# EAGLE schematic 32blit (EAGLE 9.6.2)

## Sheet 1 of 3: MCU
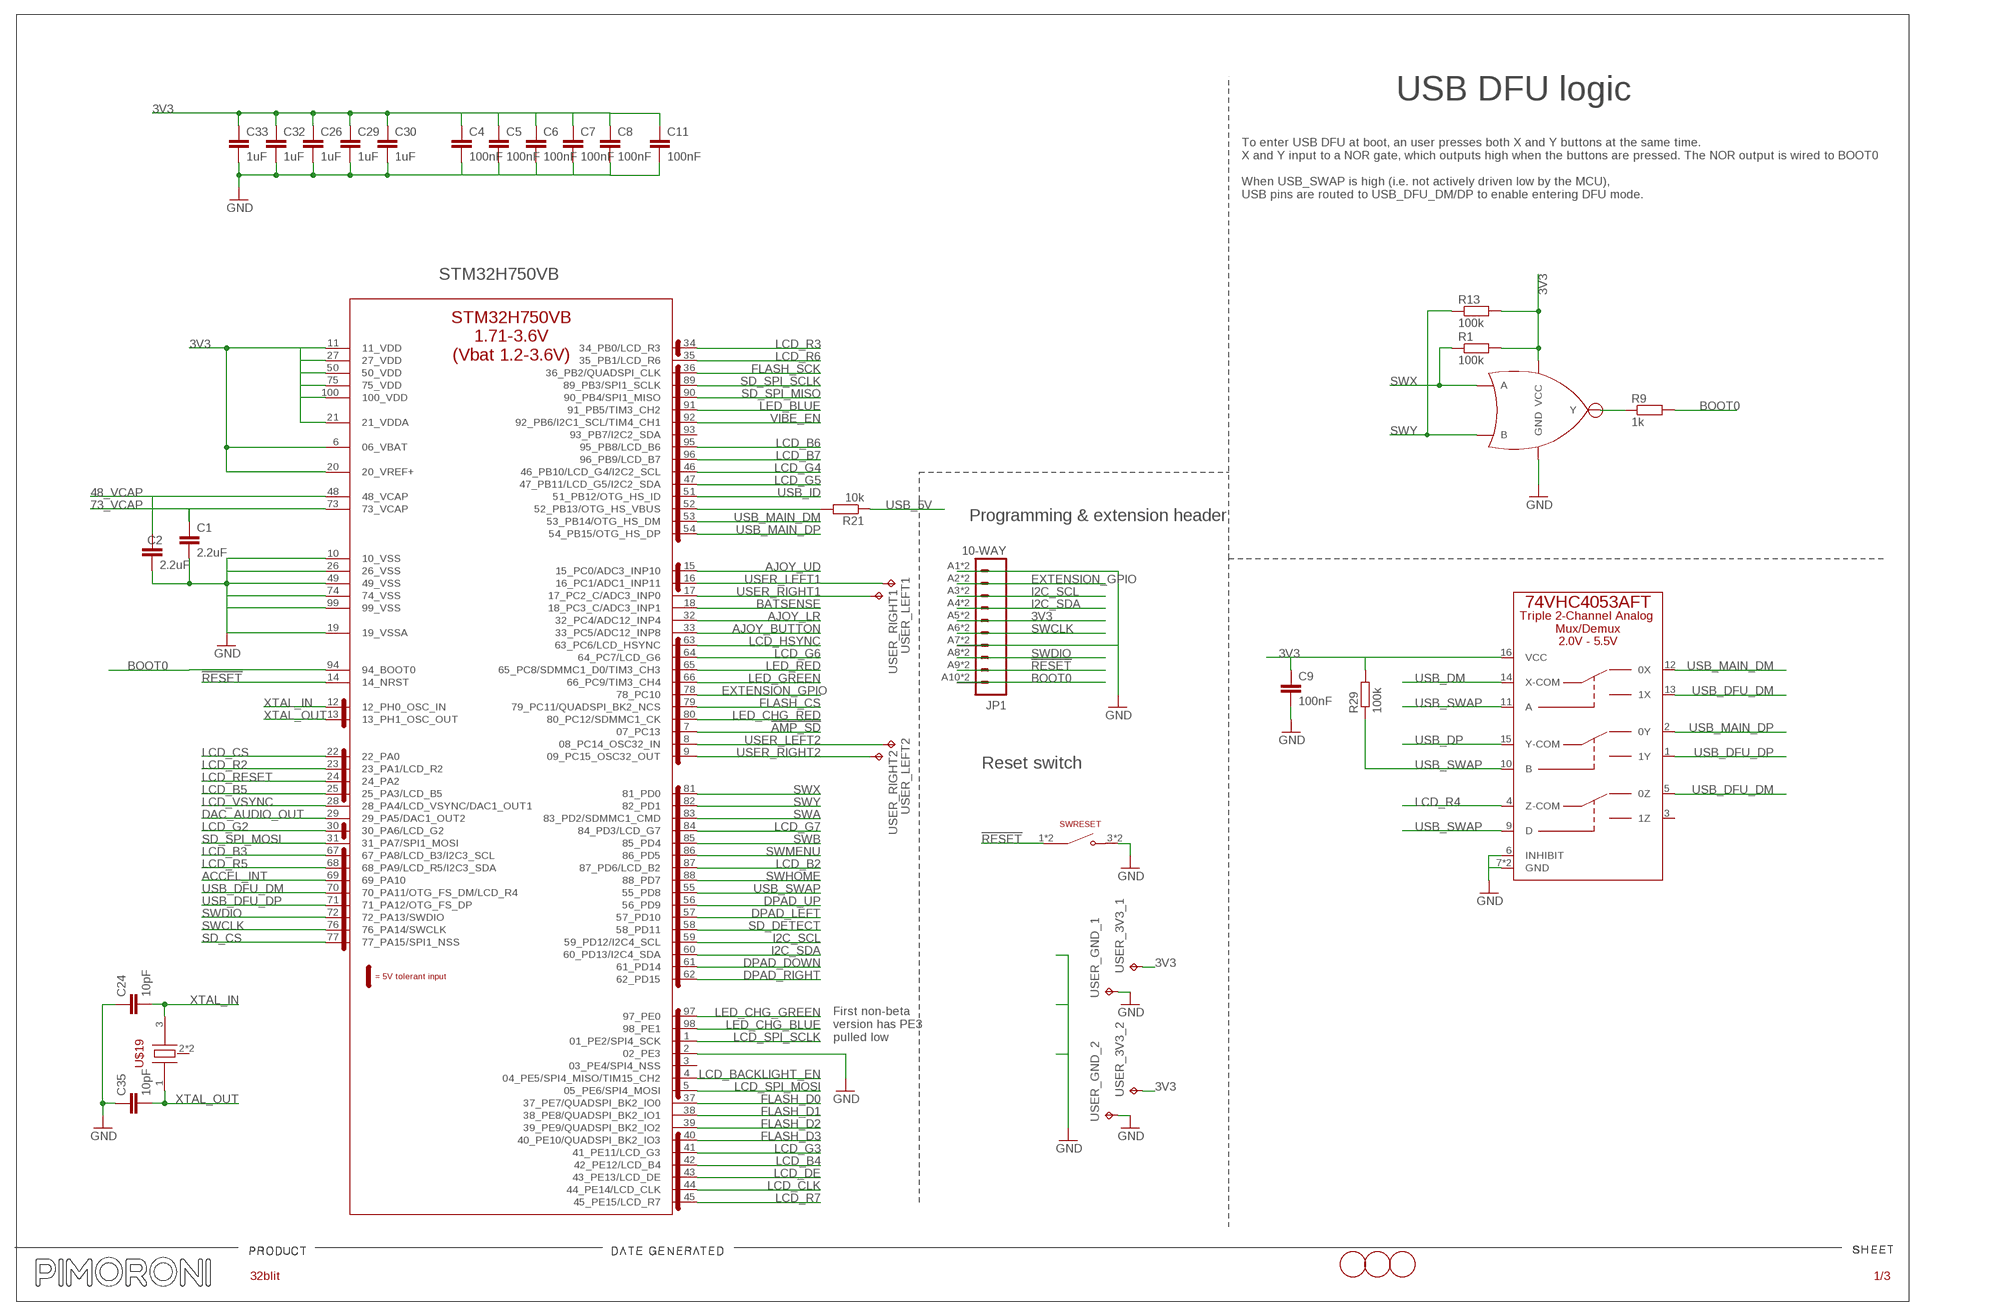
[diagram p0: schematic, sheet 1]

### Parts
C1  2.2uF  C-EUC0603  [C0603]
C2  2.2uF  C-EUC0603  [C0603]
C4  100nF  C-EUC0402K  [C0402K]
C5  100nF  C-EUC0402K  [C0402K]
C6  100nF  C-EUC0402K  [C0402K]
C7  100nF  C-EUC0402K  [C0402K]
C8  100nF  C-EUC0402K  [C0402K]
C9  100nF  C-EUC0402K  [C0402K]
C11  100nF  C-EUC0402K  [C0402K]
C24  10pF  C-EUC0603K  [C0603K]
C26  1uF  C-EUC0603  [C0603]
C29  1uF  C-EUC0603  [C0603]
C30  1uF  C-EUC0603  [C0603]
C32  1uF  C-EUC0603  [C0603]
C33  1uF  C-EUC0603  [C0603]
C35  10pF  C-EUC0603K  [C0603K]
JP1  10-WAY  [1X10_FEMALE_SMT_RIGHT_ANGLE]
R1  100k  R-EU_R0603  [R0603]
R9  1k  R-EU_R0603  [R0603]
R13  100k  R-EU_R0603  [R0603]
R21  10k  R-EU_R0603  [R0603]
R29  100k  R-EU_R0603  [R0603]
STM32H750  STM32H750VB  [LQFP-100]
SWRESET  LY-A03-02  TACT_SWITCHLOWPROFILE  [TACT_RIGHT_ANGLE_LOW_PROFILE]
U1  SN74AHC1G02  [SOT-23-5]
U8  74VHC4053AFT  [TSSOP-16-TI]
U$17  FIDUCIAL1MM  [FIDUCIAL-1MM]
U$19  ABM8G-12.000MHZ-4Y-T3  TSX-3225  [TSX-3225]
U$22  FIDUCIAL1MM  [FIDUCIAL-1MM]
U$23  FIDUCIAL1MM  [FIDUCIAL-1MM]
USER_3V3_1  TPTP17SQ  [TP17SQ]
USER_3V3_2  TPTP17SQ  [TP17SQ]
USER_GND_1  TPTP17SQ  [TP17SQ]
USER_GND_2  TPTP17SQ  [TP17SQ]
USER_LEFT1  TPTP17SQ  [TP17SQ]
USER_LEFT2  TPTP17SQ  [TP17SQ]
USER_RIGHT1  TPTP17SQ  [TP17SQ]
USER_RIGHT2  TPTP17SQ  [TP17SQ]

### Nets
3V3: C4.1 C5.1 C6.1 C7.1 C8.1 C9.1 C11.1 C26.1 C29.1 C30.1 C32.1 C33.1 JP1.A5 JP1.B5 R1.2 R13.2 R29.2 STM32H750.6(06_VBAT) STM32H750.11(11_VDD) STM32H750.20(20_VREF+) STM32H750.21(21_VDDA) STM32H750.27(27_VDD) STM32H750.50(50_VDD) STM32H750.75(75_VDD) STM32H750.100(100_VDD) U1.5(VCC) U8.16(VCC) USER_3V3_1.TP USER_3V3_2.TP ; also sheet 2,3
48_VCAP: C2.1 STM32H750.48(48_VCAP)
73_VCAP: C1.1 STM32H750.73(73_VCAP)
!AMP_SD: STM32H750.7(07_PC13) ; also sheet 2
!RESET: JP1.A9 JP1.B9 STM32H750.14(14_NRST) SWRESET.1 SWRESET.2
ACCEL_INT: STM32H750.69(69_PA10) ; also sheet 2
AJOY_BUTTON: STM32H750.33(33_PC5/ADC12_INP8) ; also sheet 2
AJOY_LR: STM32H750.32(32_PC4/ADC12_INP4) ; also sheet 2
AJOY_UD: STM32H750.15(15_PC0/ADC3_INP10) ; also sheet 2
BATSENSE: STM32H750.18(18_PC3_C/ADC3_INP1) ; also sheet 3
BOOT0: JP1.A10 JP1.B10 R9.2 STM32H750.94(94_BOOT0)
DAC_AUDIO_OUT: STM32H750.29(29_PA5/DAC1_OUT2) ; also sheet 2
DPAD_DOWN: STM32H750.61(61_PD14) ; also sheet 2
DPAD_LEFT: STM32H750.57(57_PD10) ; also sheet 2
DPAD_RIGHT: STM32H750.62(62_PD15) ; also sheet 2
DPAD_UP: STM32H750.56(56_PD9) ; also sheet 2
EXTENSION_GPIO: JP1.A2 JP1.B2 STM32H750.78(78_PC10)
FLASH_CS: STM32H750.79(79_PC11/QUADSPI_BK2_NCS) ; also sheet 2
FLASH_D0: STM32H750.37(37_PE7/QUADSPI_BK2_IO0) ; also sheet 2
FLASH_D1: STM32H750.38(38_PE8/QUADSPI_BK2_IO1) ; also sheet 2
FLASH_D2: STM32H750.39(39_PE9/QUADSPI_BK2_IO2) ; also sheet 2
FLASH_D3: STM32H750.40(40_PE10/QUADSPI_BK2_IO3) ; also sheet 2
FLASH_SCK: STM32H750.36(36_PB2/QUADSPI_CLK) ; also sheet 2
GND: C1.2 C2.2 C4.2 C5.2 C6.2 C7.2 C8.2 C9.2 C11.2 C24.1 C26.2 C29.2 C30.2 C32.2 C33.2 C35.1 JP1.A1 JP1.A7 JP1.B1 JP1.B7 STM32H750.2(02_PE3) STM32H750.10(10_VSS) STM32H750.19(19_VSSA) STM32H750.26(26_VSS) STM32H750.49(49_VSS) STM32H750.74(74_VSS) STM32H750.99(99_VSS) SWRESET.3 SWRESET.4 U1.3(GND) U8.6(INHIBIT) U8.7(GND) U8.8(GND) USER_GND_1.TP USER_GND_2.TP ; also sheet 2,3
I2C_SCL: JP1.A3 JP1.B3 STM32H750.59(59_PD12/I2C4_SCL) ; also sheet 2,3
I2C_SDA: JP1.A4 JP1.B4 STM32H750.60(60_PD13/I2C4_SDA) ; also sheet 2,3
LCD_B2: STM32H750.87(87_PD6/LCD_B2) ; also sheet 3
LCD_B3: STM32H750.67(67_PA8/LCD_B3/I2C3_SCL) ; also sheet 3
LCD_B4: STM32H750.42(42_PE12/LCD_B4) ; also sheet 3
LCD_B5: STM32H750.25(25_PA3/LCD_B5) ; also sheet 3
LCD_B6: STM32H750.95(95_PB8/LCD_B6) ; also sheet 3
LCD_B7: STM32H750.96(96_PB9/LCD_B7) ; also sheet 3
LCD_BACKLIGHT_EN: STM32H750.4(04_PE5/SPI4_MISO/TIM15_CH2) ; also sheet 3
LCD_CLK: STM32H750.44(44_PE14/LCD_CLK) ; also sheet 3
LCD_CS: STM32H750.22(22_PA0) ; also sheet 3
LCD_DE: STM32H750.43(43_PE13/LCD_DE) ; also sheet 3
LCD_G2: STM32H750.30(30_PA6/LCD_G2) ; also sheet 3
LCD_G3: STM32H750.41(41_PE11/LCD_G3) ; also sheet 3
LCD_G4: STM32H750.46(46_PB10/LCD_G4/I2C2_SCL) ; also sheet 3
LCD_G5: STM32H750.47(47_PB11/LCD_G5/I2C2_SDA) ; also sheet 3
LCD_G6: STM32H750.64(64_PC7/LCD_G6) ; also sheet 3
LCD_G7: STM32H750.84(84_PD3/LCD_G7) ; also sheet 3
LCD_HSYNC: STM32H750.63(63_PC6/LCD_HSYNC) ; also sheet 3
LCD_R2: STM32H750.23(23_PA1/LCD_R2) ; also sheet 3
LCD_R3: STM32H750.34(34_PB0/LCD_R3) ; also sheet 3
LCD_R4: U8.4(Z-COM) ; also sheet 3
LCD_R5: STM32H750.68(68_PA9/LCD_R5/I2C3_SDA) ; also sheet 3
LCD_R6: STM32H750.35(35_PB1/LCD_R6) ; also sheet 3
LCD_R7: STM32H750.45(45_PE15/LCD_R7) ; also sheet 3
LCD_RESET: STM32H750.24(24_PA2) ; also sheet 3
LCD_SPI_MOSI: STM32H750.5(05_PE6/SPI4_MOSI) ; also sheet 3
LCD_SPI_SCLK: STM32H750.1(01_PE2/SPI4_SCK) ; also sheet 3
LCD_VSYNC: STM32H750.28(28_PA4/LCD_VSYNC/DAC1_OUT1) ; also sheet 3
LED_BLUE: STM32H750.91(91_PB5/TIM3_CH2) ; also sheet 2
LED_CHG_BLUE: STM32H750.98(98_PE1) ; also sheet 3
LED_CHG_GREEN: STM32H750.97(97_PE0) ; also sheet 3
LED_CHG_RED: STM32H750.80(80_PC12/SDMMC1_CK) ; also sheet 3
LED_GREEN: STM32H750.66(66_PC9/TIM3_CH4) ; also sheet 2
LED_RED: STM32H750.65(65_PC8/SDMMC1_D0/TIM3_CH3) ; also sheet 2
N$1: R9.1 U1.4(Y)
N$2: R21.2 STM32H750.52(52_PB13/OTG_HS_VBUS)
SD_CS: STM32H750.77(77_PA15/SPI1_NSS) ; also sheet 2
SD_DETECT: STM32H750.58(58_PD11) ; also sheet 2
SD_SPI_MISO: STM32H750.90(90_PB4/SPI1_MISO) ; also sheet 2
SD_SPI_MOSI: STM32H750.31(31_PA7/SPI1_MOSI) ; also sheet 2
SD_SPI_SCLK: STM32H750.89(89_PB3/SPI1_SCLK) ; also sheet 2
SWA: STM32H750.83(83_PD2/SDMMC1_CMD) ; also sheet 2
SWB: STM32H750.85(85_PD4) ; also sheet 2
SWCLK: JP1.A6 JP1.B6 STM32H750.76(76_PA14/SWCLK)
SWDIO: JP1.A8 JP1.B8 STM32H750.72(72_PA13/SWDIO)
SWHOME: STM32H750.88(88_PD7) ; also sheet 2,3
SWMENU: STM32H750.86(86_PD5) ; also sheet 2
SWX: R1.1 STM32H750.81(81_PD0) U1.1(A) ; also sheet 2
SWY: R13.1 STM32H750.82(82_PD1) U1.2(B) ; also sheet 2
USB_5V: R21.1 ; also sheet 3
USB_DFU_DM: STM32H750.70(70_PA11/OTG_FS_DM/LCD_R4) U8.5(0Z) U8.13(1X)
USB_DFU_DP: STM32H750.71(71_PA12/OTG_FS_DP) U8.1(1Y)
USB_DM: U8.14(X-COM) ; also sheet 3
USB_DP: U8.15(Y-COM) ; also sheet 3
USB_ID: STM32H750.51(51_PB12/OTG_HS_ID) ; also sheet 3
USB_MAIN_DM: STM32H750.53(53_PB14/OTG_HS_DM) U8.12(0X)
USB_MAIN_DP: STM32H750.54(54_PB15/OTG_HS_DP) U8.2(0Y)
USB_SWAP: R29.1 STM32H750.55(55_PD8) U8.9(D) U8.10(B) U8.11(A)
USER_LEFT1: STM32H750.16(16_PC1/ADC1_INP11) USER_LEFT1.TP
USER_LEFT2: STM32H750.8(08_PC14_OSC32_IN) USER_LEFT2.TP
USER_RIGHT1: STM32H750.17(17_PC2_C/ADC3_INP0) USER_RIGHT1.TP
USER_RIGHT2: STM32H750.9(09_PC15_OSC32_OUT) USER_RIGHT2.TP
VIBE_EN: STM32H750.92(92_PB6/I2C1_SCL/TIM4_CH1) ; also sheet 2
XTAL_IN: C24.2 STM32H750.12(12_PH0_OSC_IN) U$19.3
XTAL_OUT: C35.2 STM32H750.13(13_PH1_OSC_OUT) U$19.1
Unconnected: STM32H750.3(03_PE4/SPI4_NSS) STM32H750.93(93_PB7/I2C2_SDA) U8.3(1Z) U$19.2(GND) U$19.4(GND)

### Notes on the sheet
- USB DFU logic
- To enter USB DFU at boot, an user presses both X and Y buttons at the same time.
  X and Y input to a NOR gate, which outputs high when the buttons are pressed. The NOR output is wired to BOOT0
  
  When USB_SWAP is high (i.e. not actively driven low by the MCU), 
  USB pins are routed to USB_DFU_DM/DP to enable entering DFU mode.
- STM32H750VB
- Programming & extension header
- Reset switch
- First non-beta 
  version has PE3 
  pulled low

## Sheet 2 of 3: Peripherals
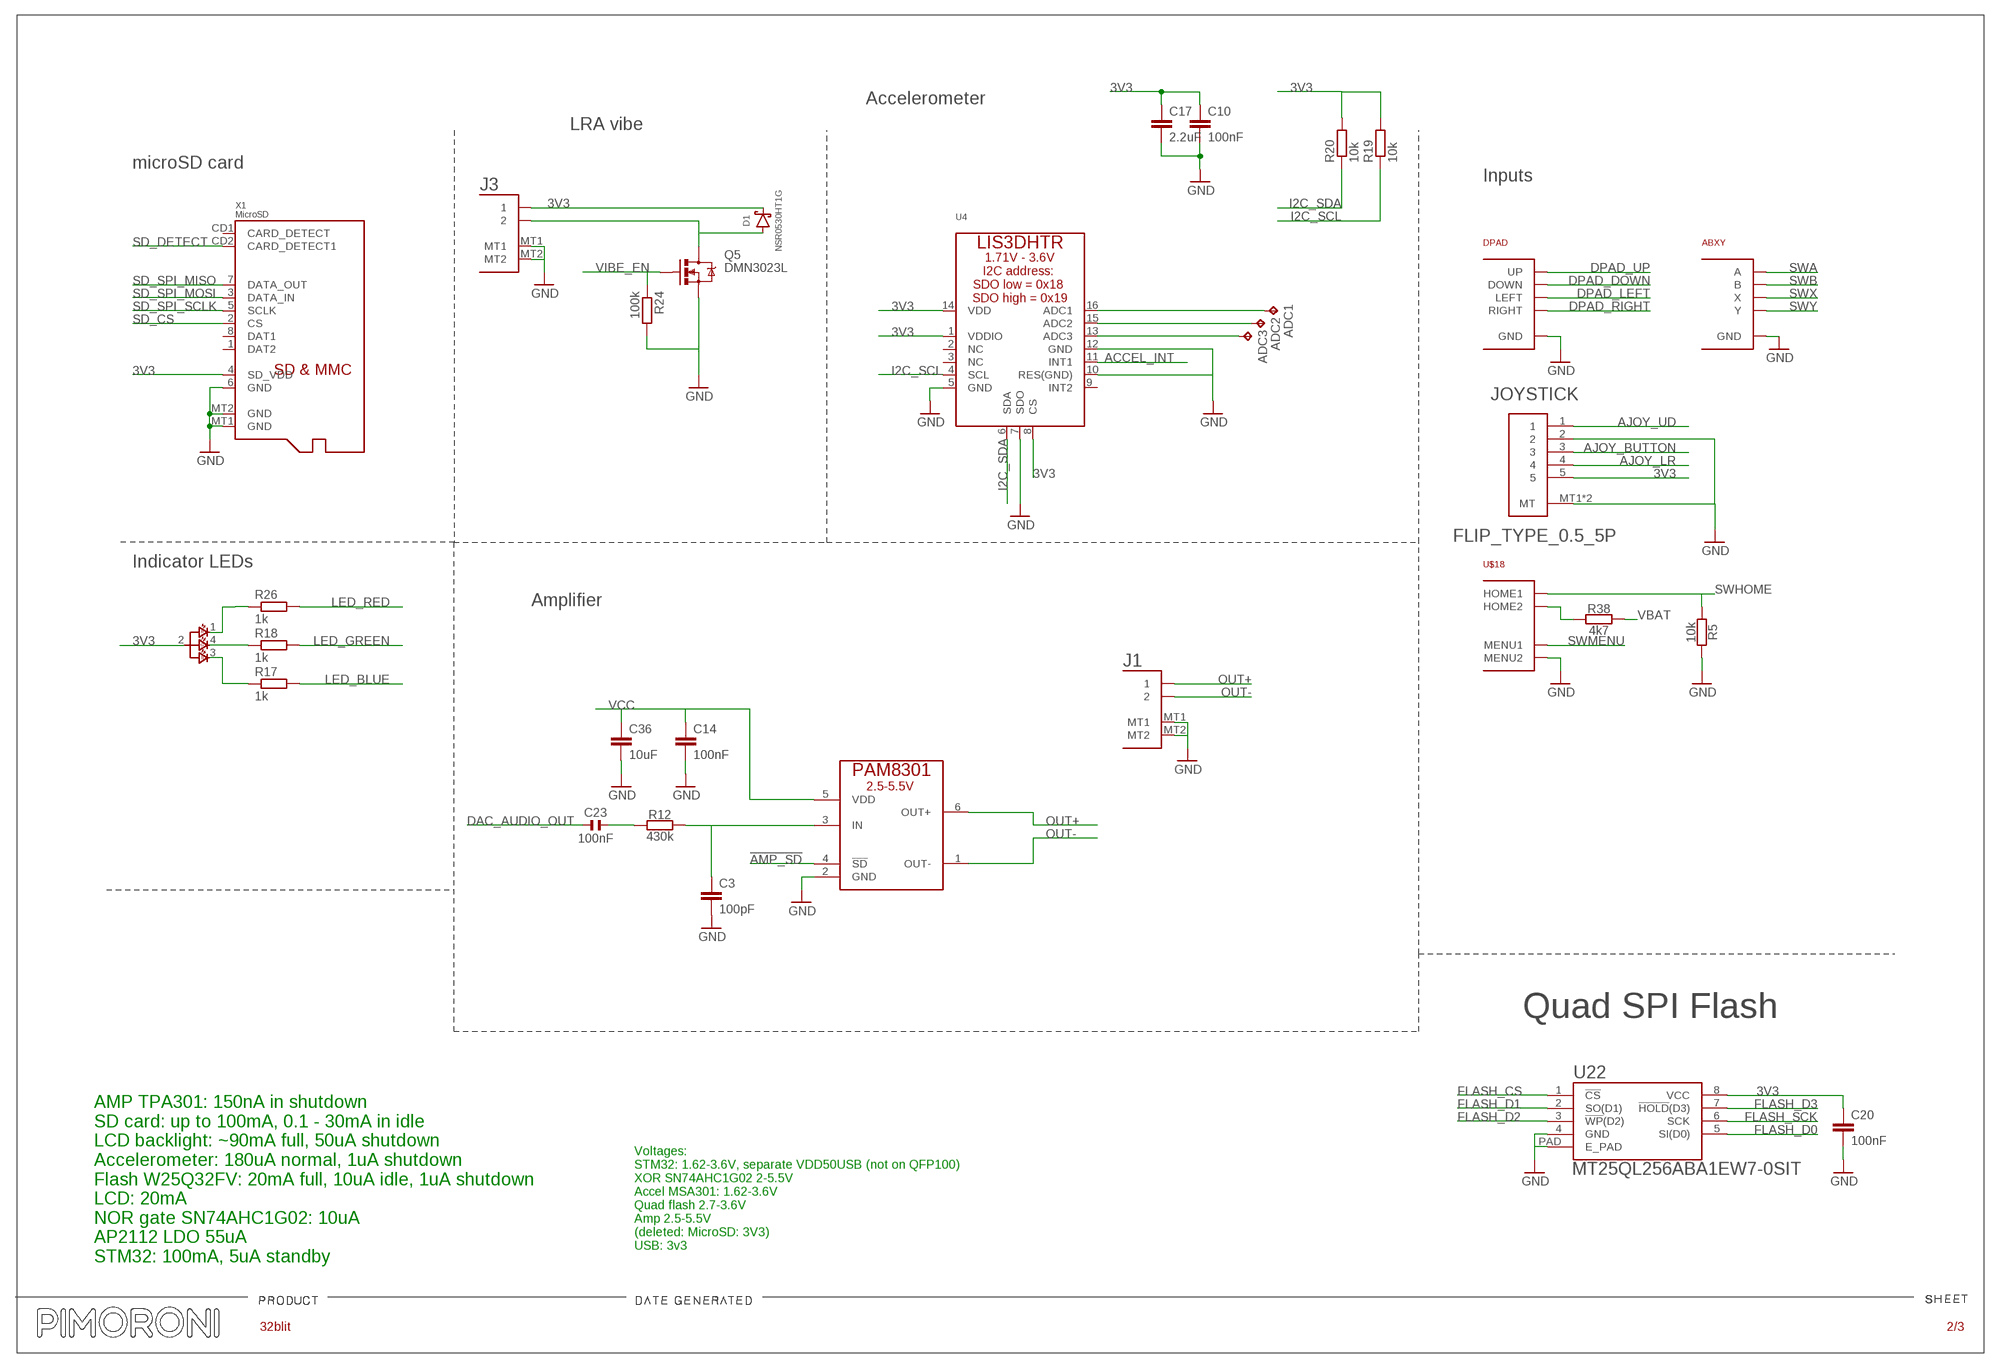
[diagram p1: schematic, sheet 2]

### Parts
ABXY  ABXY  [ABXY]
ADC1  TPTP17SQ  [TP17SQ]
ADC2  TPTP17SQ  [TP17SQ]
ADC3  TPTP17SQ  [TP17SQ]
C3  100pF  C-EUC0603  [C0603]
C10  100nF  C-EUC0402K  [C0402K]
C14  100nF  C-EUC0402K  [C0402K]
C17  2.2uF  C-EUC0603  [C0603]
C20  100nF  C-EUC0402K  [C0402K]
C23  100nF  CAPACITOR.0402  [0402]
C36  10uF  C-EUC0805  [C0805]
D1  NSR0530HT1G  DIODE-SCHOTTKY  [SOD-323]
DPAD  DPAD  [DPAD]
J1  1X02PICOBLADE  [PICOBLADE_1.25MM_2P]
J3  1X02JST_SH  [JST_SH_1.0MM_2P]
JOYSTICK  FLIP_TYPE_0.5_5P  FPC-05WAY0.5  [FPC-0.5MM-05WAY]
Q5  DMN3023L  MOSFET-NCHANNEL  [SOT23]
R5  10k  R-EU_R0603  [R0603]
R12  430k  R-EU_R0603  [R0603]
R17  1k  R-EU_R0603  [R0603]
R18  1k  R-EU_R0603  [R0603]
R19  10k  R-EU_R0603  [R0603]
R20  10k  R-EU_R0603  [R0603]
R24  100k  R-EU_R0603  [R0603]
R26  1k  R-EU_R0603  [R0603]
R38  4k7  R-EU_R0603  [R0603]
RGB2  LED_RGB_4P6028_REVERSE  [LED-6028_REVERSE_RGB]
U4  ACCEL_LIS3DHTR  [LGA16_3X3MM]
U5  PAM8301  [SOT-23-6]
U22  MT25QL256ABA1EW7-0SIT  SPI_QUAD_FLASH  [DFN-8_6X5MM]
U$18  HOME-MENU  [MENU-HOME]
X1  MicroSD  MICROSD  [MICROSD]

### Nets
3V3: C10.1 C17.1 C20.1 D1.C J3.1 JOYSTICK.5 R19.2 R20.2 RGB2.2(A) U4.1(VDDIO) U4.8(CS) U4.14(VDD) U22.8(VCC) X1.4(SD_VDD) ; also sheet 1,3
!AMP_SD: U5.4(!SD) ; also sheet 1
ACCEL_INT: U4.11(INT1) ; also sheet 1
AJOY_BUTTON: JOYSTICK.3 ; also sheet 1
AJOY_LR: JOYSTICK.4 ; also sheet 1
AJOY_UD: JOYSTICK.1 ; also sheet 1
DAC_AUDIO_OUT: C23.2 ; also sheet 1
DPAD_DOWN: DPAD.DOWN ; also sheet 1
DPAD_LEFT: DPAD.LEFT ; also sheet 1
DPAD_RIGHT: DPAD.RIGHT ; also sheet 1
DPAD_UP: DPAD.UP ; also sheet 1
FLASH_CS: U22.1(!CS) ; also sheet 1
FLASH_D0: U22.5(SI(D0)) ; also sheet 1
FLASH_D1: U22.2(SO(D1)) ; also sheet 1
FLASH_D2: U22.3(!WP!(D2)) ; also sheet 1
FLASH_D3: U22.7(!HOLD!(D3)) ; also sheet 1
FLASH_SCK: U22.6(SCK) ; also sheet 1
GND: ABXY.GND1(GND) ABXY.GND2(GND) ABXY.GND3(GND) ABXY.GND4(GND) C3.2 C10.2 C14.2 C17.2 C20.2 C36.2 DPAD.GND1(GND) DPAD.GND2(GND) DPAD.GND3(GND) DPAD.GND4(GND) J1.MT1 J1.MT2 J3.MT1 J3.MT2 JOYSTICK.2 JOYSTICK.MT1(MT) JOYSTICK.MT2(MT) Q5.2(S) R5.2 R24.2 U4.5(GND) U4.7(SDO) U4.10(RES(GND)) U4.12(GND) U5.2(GND) U22.4(GND) U22.PAD(E_PAD) U$18.GND3(MENU2) X1.6(GND) X1.MT1(GND) X1.MT2(GND) ; also sheet 1,3
I2C_SCL: R19.1 U4.4(SCL) ; also sheet 1,3
I2C_SDA: R20.1 U4.6(SDA) ; also sheet 1,3
LED_BLUE: R17.2 ; also sheet 1
LED_GREEN: R18.2 ; also sheet 1
LED_RED: R26.2 ; also sheet 1
N$4: ADC3.TP U4.13(ADC3)
N$5: C3.1 R12.2 U5.3(IN)
N$6: R18.1 RGB2.4(GC)
N$7: R17.1 RGB2.3(BC)
N$8: C23.1 R12.1
N$9: ADC2.TP U4.15(ADC2)
N$10: ADC1.TP U4.16(ADC1)
N$14: D1.A J3.2 Q5.3(D)
N$17: R26.1 RGB2.1(RC)
N$47: R38.1 U$18.GND4(HOME2)
OUT+: J1.1 U5.6(OUT+)
OUT-: J1.2 U5.1(OUT-)
SD_CS: X1.2(CS) ; also sheet 1
SD_DETECT: X1.CD2(CARD_DETECT1) ; also sheet 1
SD_SPI_MISO: X1.7(DATA_OUT) ; also sheet 1
SD_SPI_MOSI: X1.3(DATA_IN) ; also sheet 1
SD_SPI_SCLK: X1.5(SCLK) ; also sheet 1
SWA: ABXY.A ; also sheet 1
SWB: ABXY.B ; also sheet 1
SWHOME: R5.1 U$18.HOME(HOME1) ; also sheet 1,3
SWMENU: U$18.MENU(MENU1) ; also sheet 1
SWX: ABXY.X ; also sheet 1
SWY: ABXY.Y ; also sheet 1
VBAT: R38.2 ; also sheet 3
VCC: C14.1 C36.1 U5.5(VDD) ; also sheet 3
VIBE_EN: Q5.1(G) R24.1 ; also sheet 1
Unconnected: U4.2(NC) U4.3(NC) U4.9(INT2) X1.1(DAT2) X1.8(DAT1) X1.CD1(CARD_DETECT)

### Notes on the sheet
- Accelerometer
- LRA vibe
- microSD card
- Inputs
- Indicator LEDs
- Amplifier
- Quad SPI Flash
- Voltages:
  STM32: 1.62-3.6V, separate VDD50USB (not on QFP100)
  XOR SN74AHC1G02 2-5.5V
  Accel MSA301: 1.62-3.6V 
  Quad flash 2.7-3.6V
  Amp 2.5-5.5V
  (deleted: MicroSD: 3V3)
  USB: 3v3
- AMP TPA301: 150nA in shutdown
  SD card: up to 100mA, 0.1 - 30mA in idle
  LCD backlight: ~90mA full, 50uA shutdown
  Accelerometer: 180uA normal, 1uA shutdown
  Flash W25Q32FV: 20mA full, 10uA idle, 1uA shutdown
  LCD: 20mA
  NOR gate SN74AHC1G02: 10uA
  AP2112 LDO 55uA
  STM32: 100mA, 5uA standby

## Sheet 3 of 3: LCDs and Power
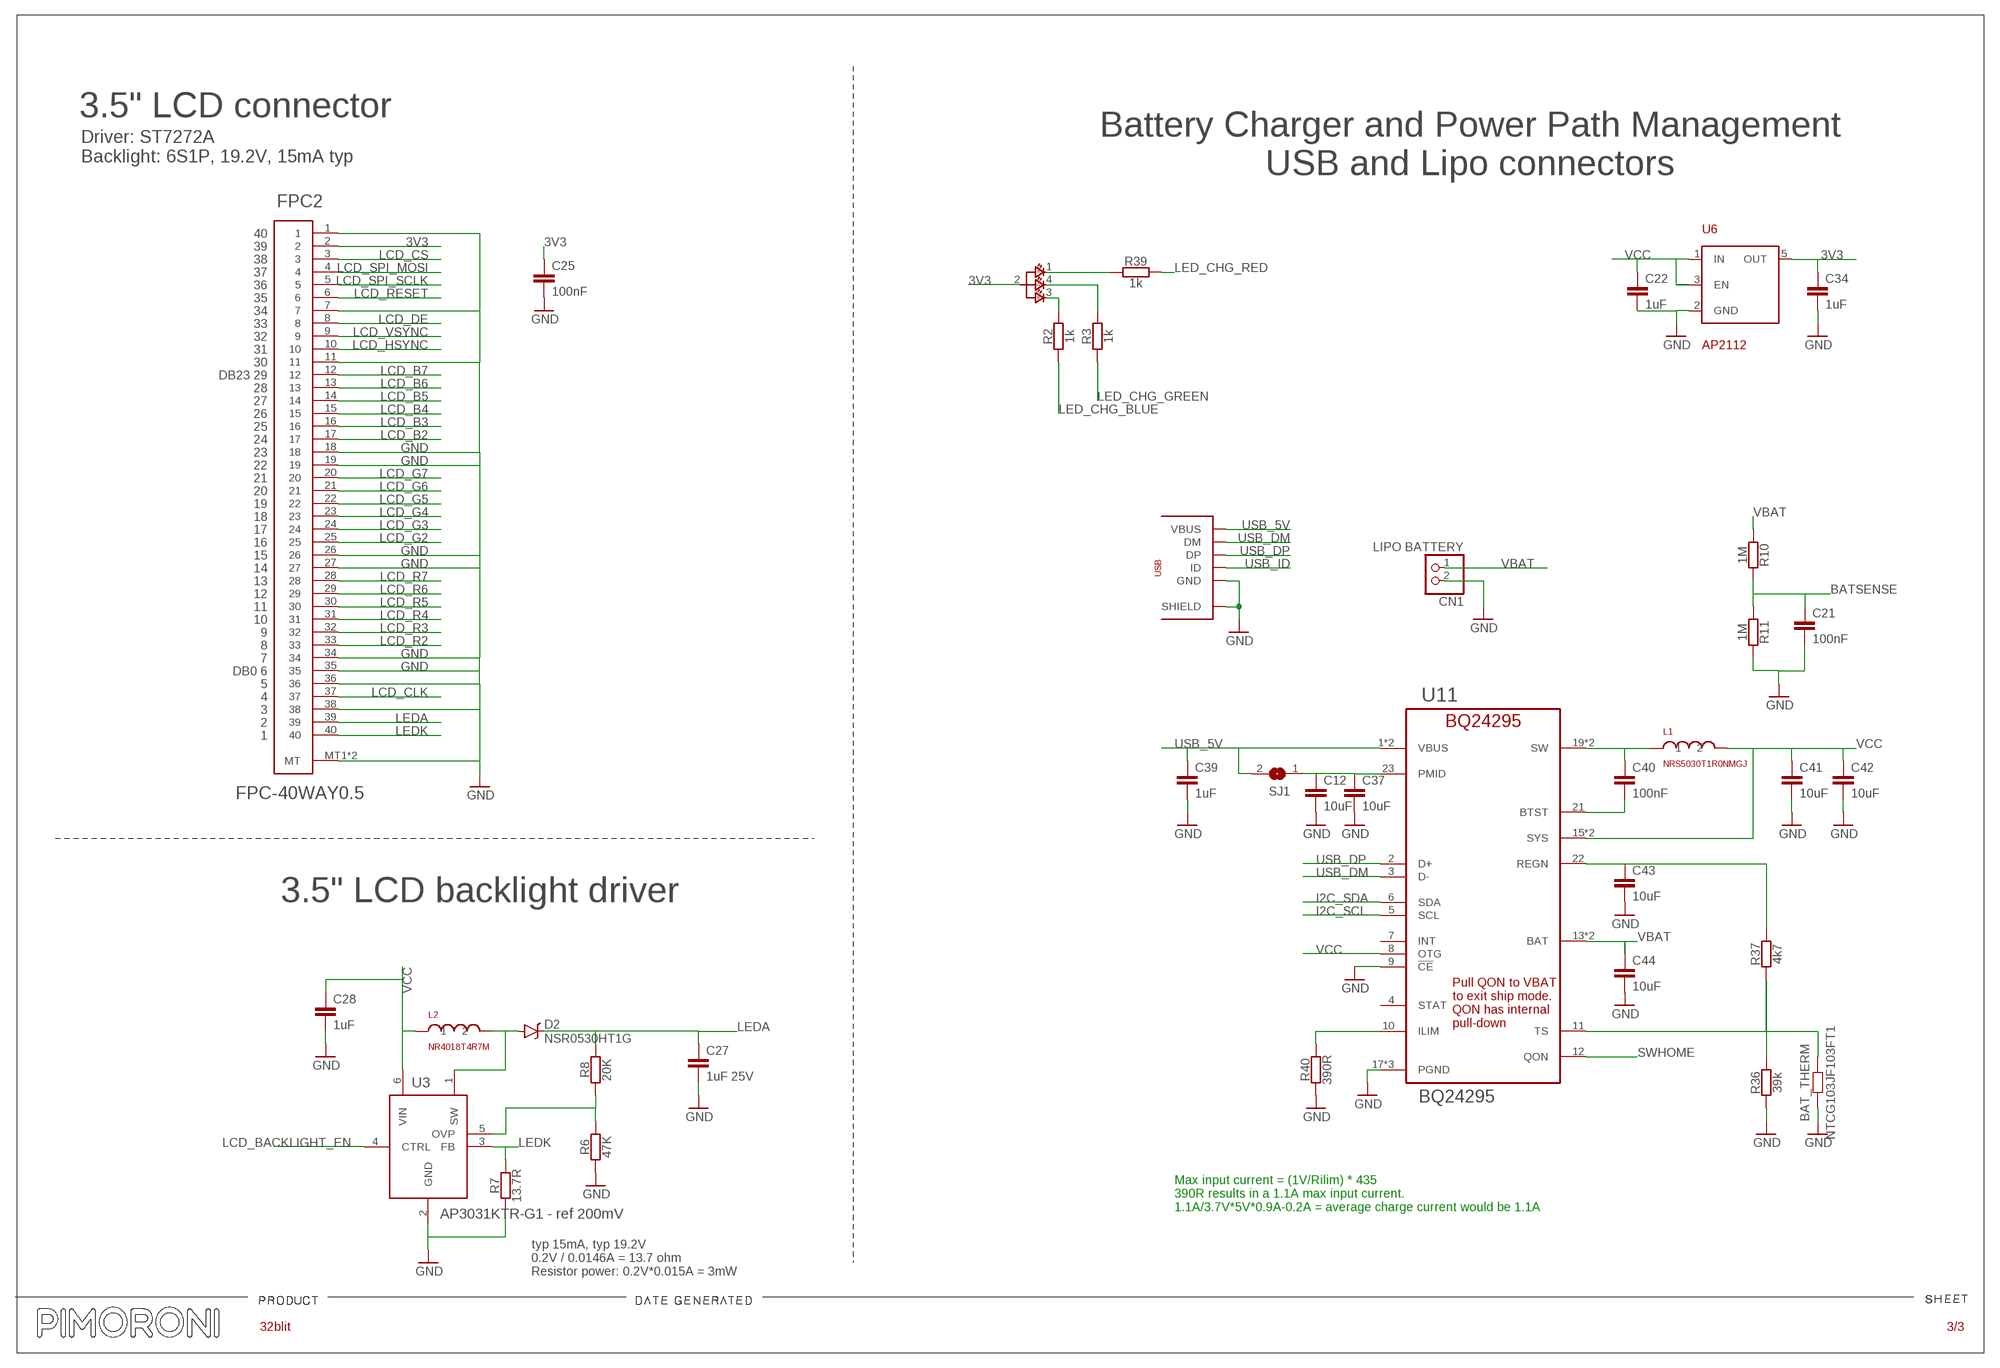
[diagram p2: schematic, sheet 3]

### Parts
BAT_THERM  NTCG103JF103FT1  RESISTOR.0402  [0402@1]
C12  10uF  C-EUC0805  [C0805]
C21  100nF  C-EUC0402K  [C0402K]
C22  1uF  C-EUC0603  [C0603]
C25  100nF  C-EUC0402K  [C0402K]
C27  1uF 25V  C-EUC0603  [C0603]
C28  1uF  C-EUC0603  [C0603]
C34  1uF  C-EUC0603  [C0603]
C37  10uF  C-EUC0805  [C0805]
C39  1uF  C-EUC0603  [C0603]
C40  100nF  C-EUC0402K  [C0402K]
C41  10uF  C-EUC0805  [C0805]
C42  10uF  C-EUC0805  [C0805]
C43  10uF  C-EUC0805  [C0805]
C44  10uF  C-EUC0805  [C0805]
CN1  LIPO BATTERY  JST_2PIN-SMT-RA  [JST-PH-2-SMT-RA]
D2  NSR0530HT1G  [NSR0530HT1G]
FPC2  FPC-40WAY0.5  [FPC-0.5MM-40WAY]
L1  NRS5030T1R0NMGJ  NRS5030  [NRS5030]
L2  NR4018T4R7M  [NR4018]
R2  1k  R-EU_R0603  [R0603]
R3  1k  R-EU_R0603  [R0603]
R6  47K  R-EU_R0603  [R0603]
R7  13.7R  R-EU_R0603  [R0603]
R8  20K  R-EU_R0603  [R0603]
R10  1M  R-EU_R0603  [R0603]
R11  1M  R-EU_R0603  [R0603]
R36  39k  R-EU_R0603  [R0603]
R37  4k7  R-EU_R0603  [R0603]
R39  1k  R-EU_R0603  [R0603]
R40  390R  R-EU_R0603  [R0603]
RGB1  LED_RGB_4P6028_REVERSE  [LED-6028_REVERSE_RGB]
SJ1  SOLDERJUMPER  [SOLDERJUMPER_ARROW_NOPASTE]
U3  AP3031KTR-G1 - ref 200mV  AP30XX_OVP  [SOT23-6L]
U6  AP2112  [SOT-23-5]
U11  BQ24295  [QFN50P400X400X100-25N]
U$3  FCI 10118193-0001LF  USBMICROB  [MICROB-USB]

### Nets
3V3: C25.1 C34.1 FPC2.2 RGB1.2(A) U6.5(OUT) ; also sheet 1,2
BATSENSE: C21.1 R10.2 R11.1 ; also sheet 1
GND: BAT_THERM.1 C12.2 C21.2 C22.2 C25.2 C27.2 C28.2 C34.2 C37.2 C39.2 C41.2 C42.2 C43.2 C44.2 CN1.2 FPC2.1 FPC2.7 FPC2.11 FPC2.18 FPC2.19 FPC2.26 FPC2.27 FPC2.34 FPC2.35 FPC2.36 FPC2.38 FPC2.MT1(MT) FPC2.MT2(MT) R6.1 R7.1 R11.2 R36.1 R40.1 U3.2(GND) U6.2(GND) U11.9(!CE) U11.17(PGND) U11.18(PGND) U11.25(PGND) U$3.GND U$3.SH1(SHIELD) U$3.SH2(SHIELD) U$3.SH3(SHIELD) U$3.SH4(SHIELD) U$3.SH5(SHIELD) U$3.SH6(SHIELD) U$3.SH7(SHIELD) U$3.SH8(SHIELD) ; also sheet 1,2
I2C_SCL: U11.5(SCL) ; also sheet 1,2
I2C_SDA: U11.6(SDA) ; also sheet 1,2
LCD_B2: FPC2.17 ; also sheet 1
LCD_B3: FPC2.16 ; also sheet 1
LCD_B4: FPC2.15 ; also sheet 1
LCD_B5: FPC2.14 ; also sheet 1
LCD_B6: FPC2.13 ; also sheet 1
LCD_B7: FPC2.12 ; also sheet 1
LCD_BACKLIGHT_EN: U3.4(CTRL) ; also sheet 1
LCD_CLK: FPC2.37 ; also sheet 1
LCD_CS: FPC2.3 ; also sheet 1
LCD_DE: FPC2.8 ; also sheet 1
LCD_G2: FPC2.25 ; also sheet 1
LCD_G3: FPC2.24 ; also sheet 1
LCD_G4: FPC2.23 ; also sheet 1
LCD_G5: FPC2.22 ; also sheet 1
LCD_G6: FPC2.21 ; also sheet 1
LCD_G7: FPC2.20 ; also sheet 1
LCD_HSYNC: FPC2.10 ; also sheet 1
LCD_R2: FPC2.33 ; also sheet 1
LCD_R3: FPC2.32 ; also sheet 1
LCD_R4: FPC2.31 ; also sheet 1
LCD_R5: FPC2.30 ; also sheet 1
LCD_R6: FPC2.29 ; also sheet 1
LCD_R7: FPC2.28 ; also sheet 1
LCD_RESET: FPC2.6 ; also sheet 1
LCD_SPI_MOSI: FPC2.4 ; also sheet 1
LCD_SPI_SCLK: FPC2.5 ; also sheet 1
LCD_VSYNC: FPC2.9 ; also sheet 1
LED_CHG_BLUE: R2.1 ; also sheet 1
LED_CHG_GREEN: R3.1 ; also sheet 1
LED_CHG_RED: R39.2 ; also sheet 1
LEDA: C27.1 D2.C FPC2.39 R8.2
LEDK: FPC2.40 R7.2 U3.3(FB)
N$3: D2.A L2.2 U3.1(SW)
N$11: R2.2 RGB1.3(BC)
N$12: R3.2 RGB1.4(GC)
N$16: R39.1 RGB1.1(RC)
N$26: R6.2 R8.1 U3.5(OVP)
N$43: R40.2 U11.10(ILIM)
N$44: C40.2 U11.21(BTST)
N$45: BAT_THERM.2 R36.2 R37.1 U11.11(TS)
N$50: C40.1 L1.1 U11.19(SW) U11.20(SW)
N$937591: C12.1 C37.1 SJ1.1 U11.23(PMID)
REGN: C43.1 R37.2 U11.22(REGN)
SWHOME: U11.12(QON) ; also sheet 1,2
USB_5V: C39.1 SJ1.2 U11.1(VBUS) U11.24(VBUS) U$3.VBUS ; also sheet 1
USB_DM: U11.3(D-) U$3.DM ; also sheet 1
USB_DP: U11.2(D+) U$3.DP ; also sheet 1
USB_ID: U$3.ID ; also sheet 1
VBAT: C44.1 CN1.1 R10.1 U11.13(BAT) U11.14(BAT) ; also sheet 2
VCC: C22.1 C28.1 C41.1 C42.1 L1.2 L2.1 U3.6(VIN) U6.1(IN) U6.3(EN) U11.8(OTG) U11.15(SYS) U11.16(SYS) ; also sheet 2
Unconnected: U11.4(STAT) U11.7(INT)

### Notes on the sheet
- 3.5" LCD connector
- Driver: ST7272A
  Backlight: 6S1P, 19.2V, 15mA typ
- Battery Charger and Power Path Management
  USB and Lipo connectors
- 40
- 39
- 38
- 37
- 36
- 35
- 34
- 33
- 32
- 31
- 30
- DB23 29
- 28
- 27
- 26
- 25
- 24
- 23
- 22
- 21
- 20
- 19
- 18
- 17
- 16
- 15
- 14
- 13
- 12
- 11
- 10
- 9
- 8
- 7
- DB0 6
- 5
- 4
- 3
- 2
- 1
- 3.5" LCD backlight driver
- Max input current = (1V/Rilim) * 435
  390R results in a 1.1A max input current. 
  1.1A/3.7V*5V*0.9A-0.2A = average charge current would be 1.1A
- typ 15mA, typ 19.2V
  0.2V / 0.0146A = 13.7 ohm
  Resistor power: 0.2V*0.015A = 3mW

## Library data of the parts
ABXY = pimoroni-mechanical:ABXY
ADC1-ADC3 USER_3V3_1 USER_3V3_2 USER_GND_1 USER_GND_2 USER_LEFT1 USER_LEFT2 USER_RIGHT1 USER_RIGHT2 = testpad:TP: Test pad
BAT_THERM = 0201_0402:RESISTOR
C1-C3 C10 C12 C14 C17 C22 C26-C30 C32-C34 C36 C37 C39 C41-C44 = resistor:C-EU: CAPACITOR, European symbol
C4-C9 C11 C20 C21 C24 C25 C35 C40 = rcl:C-EU: CAPACITOR, European symbol; SPICEPREFIX: C
C23 = 0201_0402:CAPACITOR
CN1 = adafruit:JST_2PIN: JST 2-Pin Connectors of various flavors SMT-RA (S2B-PH-SM4) 4UConnector #17311 SMT (B2B-PH-SM4) THM-RA (S2B-PH) THM (B2B-PH)
D1 = pimoroni-passives:DIODE-SCHOTTKY
D2 = pimoroni-passives:NSR0530HT1G
DPAD = pimoroni-mechanical:DPAD
FPC2 = pimoroni-fpc:FPC-40WAY
J1 J3 = pimoroni-connectors:1X02
JOYSTICK = pimoroni-fpc:FPC-05WAY
JP1 = pimoroni-headers:10-WAY: Header 10 Standard 10-pin 0.1" header. Use with straight break away headers (SKU : PRT-00116), right angle break away headers (PRT-00553), swiss pins (PRT-00743), machine pins (PRT-00117), and female headers (PRT-00115).
L1 = pimoroni-passives:NRS5030
L2 = pimoroni-passives:NR4018T4R7M
Q5 = pimoroni-passives:MOSFET-NCHANNEL
R1-R3 R5-R13 R17-R21 R24 R26 R29 R36-R40 = resistor:R-EU_: RESISTOR, European symbol
RGB1 RGB2 = pimoroni-optoelectronics:LED_RGB_4P
SJ1 = microbuilder:SOLDERJUMPER: SMD Solder JUMPER Solder the two pads together to create a connection, or remove the solder to break it. REFLOW - Use this footprint for solder paste and reflow ovens. WAVE - Use this footprint for hand-soldering (larger pads). CLOSED - Has a trace between the two pads to ensure it is closed by default. The trace needs to be cut to disable the jumper, and can be closed again by creating a solder bridge between the two pads.; BOM: EXCLUDE
STM32H750 = pimoroni-ics:STM32H750VB
SWRESET = pimoroni-mechanical:TACT_SWITCH
U1 = pimoroni-ics:SN74AHC1G02
U3 = edits:AP30XX_OVP
U4 = edits:ACCEL_LIS3DHTR: LIS3DHTR 3-Axis Accelerometer with I2C/SPI Interface VDD: 1.71-3.6V VDDIO: 1.71-VDD+0.1V Scale: +/-2g, 4g, 8g, 16g with 16--bit data output Temp:: -40°C - 85°C Mouser: 511-LIS3DHTR Digikey: 497-10613-1-ND
U5 = pimoroni-ics:PAM8301
U6 = pimoroni-ics:AP2112
U8 = pimoroni-ics:74VHC4053AFT
U11 = edits:BQ24295: Stand-Alone Synchronous Switch-Mode; MPN: BQ24610RGER; OC_FARNELL: -; OC_NEWARK: 63R9861; PACKAGE: VQFN-24; SUPPLIER: Texas Instruments
U22 = pimoroni-ics:SPI_QUAD_FLASH
U$3 = pimoroni-connectors:USB
U$17 U$22 U$23 = pimoroni:FIDUCIAL: 2mm fiducial for pick and place
U$18 = pimoroni-mechanical:HOME-MENU
U$19 = pimoroni-passives:TSX-3225
X1 = microbuilder:MICROSD: MicroSD/Transflash Card Holder with SPI pinout 3M: 2908-05WB-MG 4UConnector: 19656 Footprint courtesy: Adafruit Industries